# EAGLE design rtc (EAGLE 9.5.1)
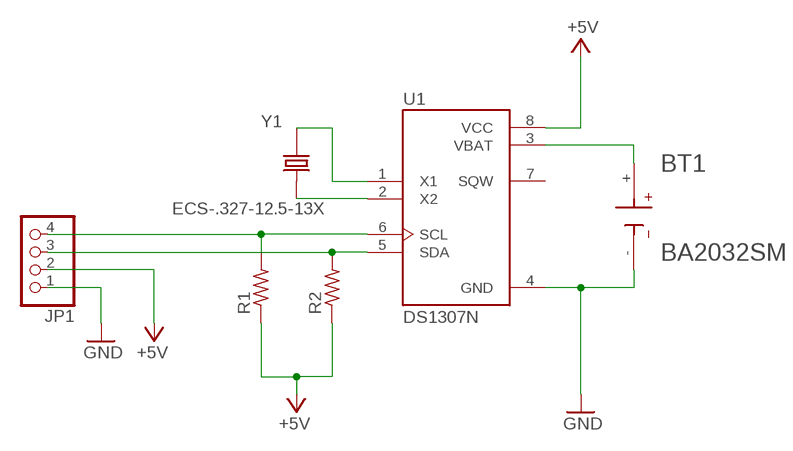
[diagram p0: schematic, sheet 1]

## Parts
BT1  BA2032SM  [BAT_BA2032SM]
JP1  PINHD-1X4  [1X04]
R1  R-US_R0805  [R0805]
R2  R-US_R0805  [R0805]
U1  DS1307N  [DIP762W47P254L991H457Q8]
Y1  ECS-.327-12.5-13X  [XTAL_ECS-.327-12.5-13X]

## Nets
+5V: JP1.2 R1.1 R2.1 U1.8(VCC)
GND: BT1.- JP1.1 U1.4(GND)
N$1: U1.2(X2) Y1.2
N$2: U1.1(X1) Y1.1
N$3: JP1.4 R1.2 U1.6(SCL)
N$4: JP1.3 R2.2 U1.5(SDA)
N$5: BT1.+ U1.3(VBAT)
Unconnected: U1.7(SQW)

## Library data of the parts
BT1 = BA2032SM:BA2032SM: BATTERY HOLDER COIN 20MM SMD; DESCRIPTION: BATTERY HOLDER COIN 20MM SMD; DIGI-KEY_PART_NUMBER: BA2032SM-ND; DIGI-KEY_PURCHASE_URL: https://www.digikey.com/product-detail/en/mpd-memory-protection-devices/BA2032SM/BA2032SM-ND/257743?utm_source=snapeda&utm_medium=aggregator&utm_campaign=symbol; MF: MPD; MP: BA2032SM; PACKAGE: None
JP1 = pinhead:PINHD-1X4: PIN HEADER
R1 R2 = rcl:R-US_: RESISTOR, American symbol; SPICEPREFIX: R
U1 = DS1307N:DS1307N: Real Time Clock Serial 56Byte 8-Pin PDIP N; DESCRIPTION: Real Time Clock _RTC_ IC Clock/Calendar 56B I²C, 2-Wire Serial 8-DIP _0.300, 7.62mm_; DIGI-KEY_PART_NUMBER: DS1307N+-ND; DIGI-KEY_PURCHASE_URL: https://www.digikey.com/product-detail/en/maxim-integrated/DS1307N-/DS1307N--ND/1196883?utm_source=snapeda&utm_medium=aggregator&utm_campaign=symbol; MF: Maxim Integrated; MP: DS1307N+; PACKAGE: PDIP-8 Maxim
Y1 = ECS-.327-12.5-13X:ECS-.327-12.5-13X: Crystal Cylindrical Can, Radial; DESCRIPTION: 32.768kHz ±20ppm Crystal 12.5pF 35 kOhms Cylindrical Can, Radial; DIGI-KEY_PART_NUMBER: X1124-ND; DIGI-KEY_PURCHASE_URL: https://www.digikey.com/product-detail/en/ecs-inc/ECS-.327-12.5-13X/X1124-ND/827615?utm_source=snapeda&utm_medium=aggregator&utm_campaign=symbol; MF: ECS Inc.; MP: ECS-.327-12.5-13X; PACKAGE: Cylindrical Can Radial ECS International

## Board
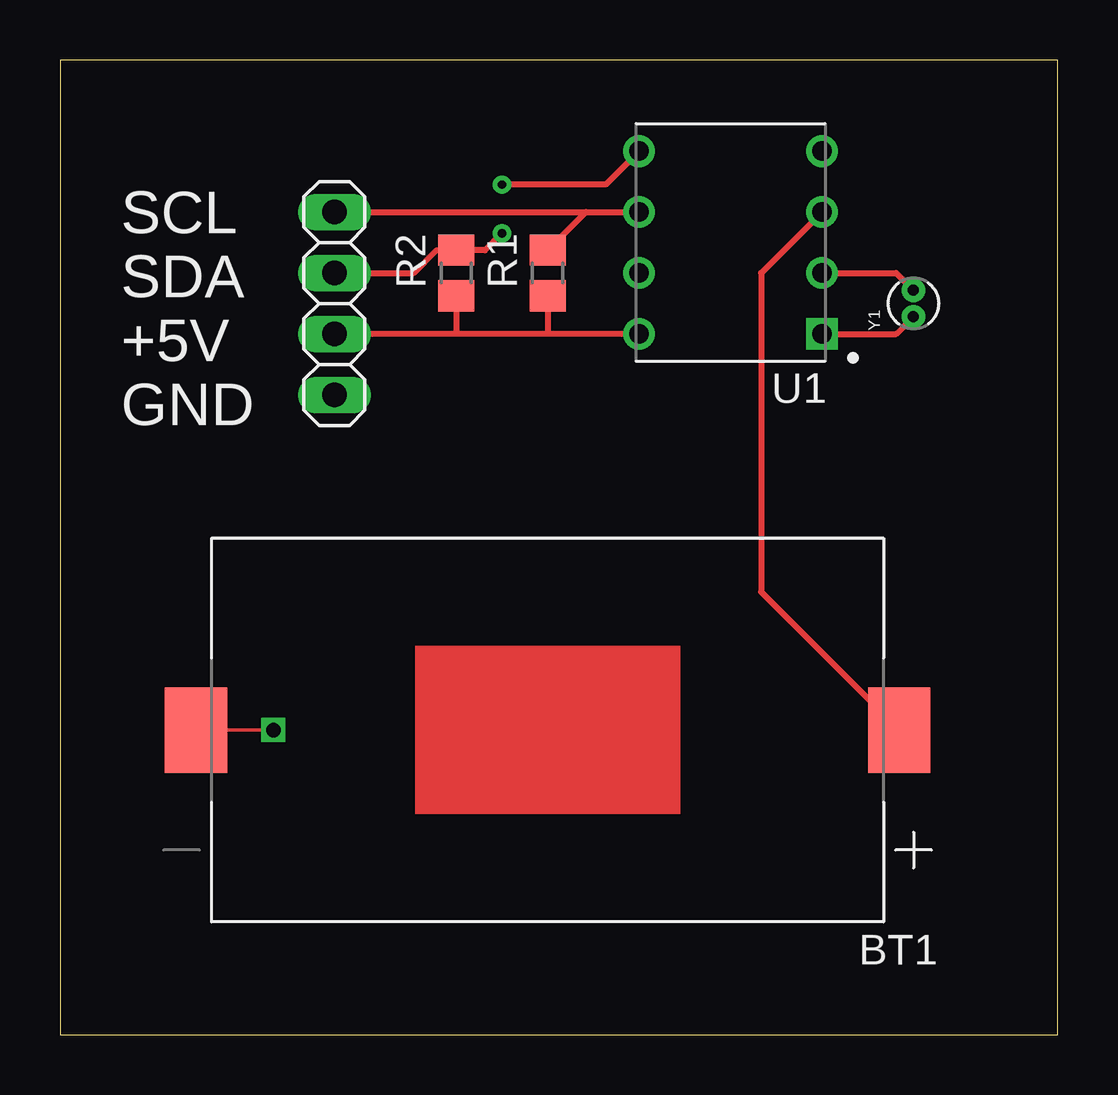
[diagram p1: board, top side]
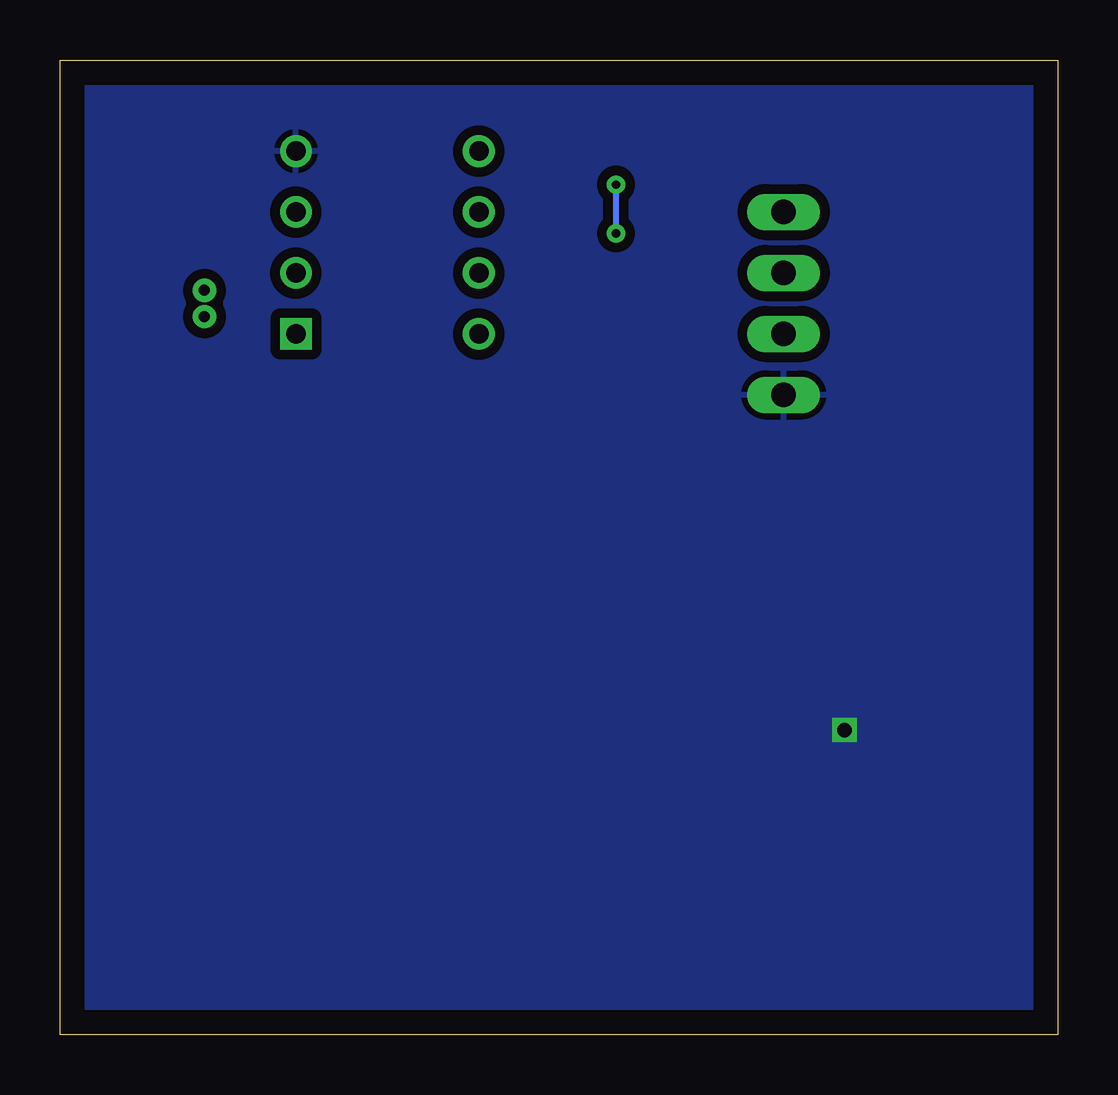
[diagram p2: board, bottom side, seen from below]

Size 41.58 x 40.63 mm. Coordinates in mm from the lower left corner, seen from the top.
Outline: 0,0 41.58,0 41.58,40.63 0,40.63 0,0
Copper layers (1*16): Top 0.035mm / dielectric 1.5mm / Bottom 0.035mm
Design rules "default": minimum track width 6mil, minimum drill 0.35mm, track to track 6mil, track to pad 6mil, pad to pad 6mil, via to via 6mil, smd to smd 6mil, copper to edge 40mil, drill to drill 6mil, minimum pad ring 10mil, minimum via ring 8mil, stop-mask expansion 4mil, vias tented up to drill 0mil, thermal gap 10mil

### Footprints (pad centres in the part's own frame; a part is rotated, then mirrored left to right if it is on the bottom)
BAT_BA2032SM = smd 2.6 x 3.56: + -14.65,0; - 14.65,0
1X04 = drill 1.016 long: 1 -3.81,0; 2 -1.27,0; 3 1.27,0; 4 3.81,0
R0805 = smd 1.3 x 1.5: 1 -0.95,0; 2 0.95,0
DIP762W47P254L991H457Q8 = drill 0.81 square: 1 -3.81,3.81 | drill 0.81: 2 -3.81,1.27; 3 -3.81,-1.27; 4 -3.81,-3.81; 5 3.81,-3.81; 6 3.81,-1.27; 7 3.81,1.27; 8 3.81,3.81
XTAL_ECS-.327-12.5-13X = drill 0.46 pad 0.86: 1 -0.55,0; 2 0.55,0

### Placement (x,y rotation side)
BT1  20.32,12.7 180 top
JP1  11.43,30.48 90 top
R1  20.32,31.75 90 top
R2  16.51,31.75 90 top
U1  27.94,33.02 180 top
Y1  35.56,30.48 90 top

### Tracks (layer width: path | path; a pad name or v marks a point on that pad's centre or on a via)
+5V
  Top 0.254: U1.8 20.32,29.21 | 20.32,29.21 16.51,29.21 | 16.51,29.21 JP1.2 | R2.1 16.51,29.21 | R1.1 20.32,29.21
GND  (via drill 0.6)
  Top 0.152: BT1.- v8.89,12.7
  pour Bottom (isolate 0.406): -2.54,41.91 44.45,41.91 44.45,-1.27 -2.54,-1.27
N$1
  Top 0.254: U1.2 34.84,31.75 Y1.2
N$2
  Top 0.254: U1.1 34.84,29.21 Y1.1
N$3
  Top 0.254: R1.2 21.91,34.29 U1.6 JP1.4
N$4  (via drill 0.35)
  Top 0.254: JP1.3 14.73,31.75 15.68,32.7 R2.2 17.71,32.7 v18.41,33.4 | U1.5 22.73,35.43 v18.41,35.43
  Bottom 0.254: v18.41,35.43 v18.41,33.4
N$5
  Top 0.254: U1.3 29.21,31.75 29.21,18.46 BT1.+

### Text on the board
tNames: SCL / SDA / +5V / GND